# Altium project BodyCaINv0.1.PrjPcb
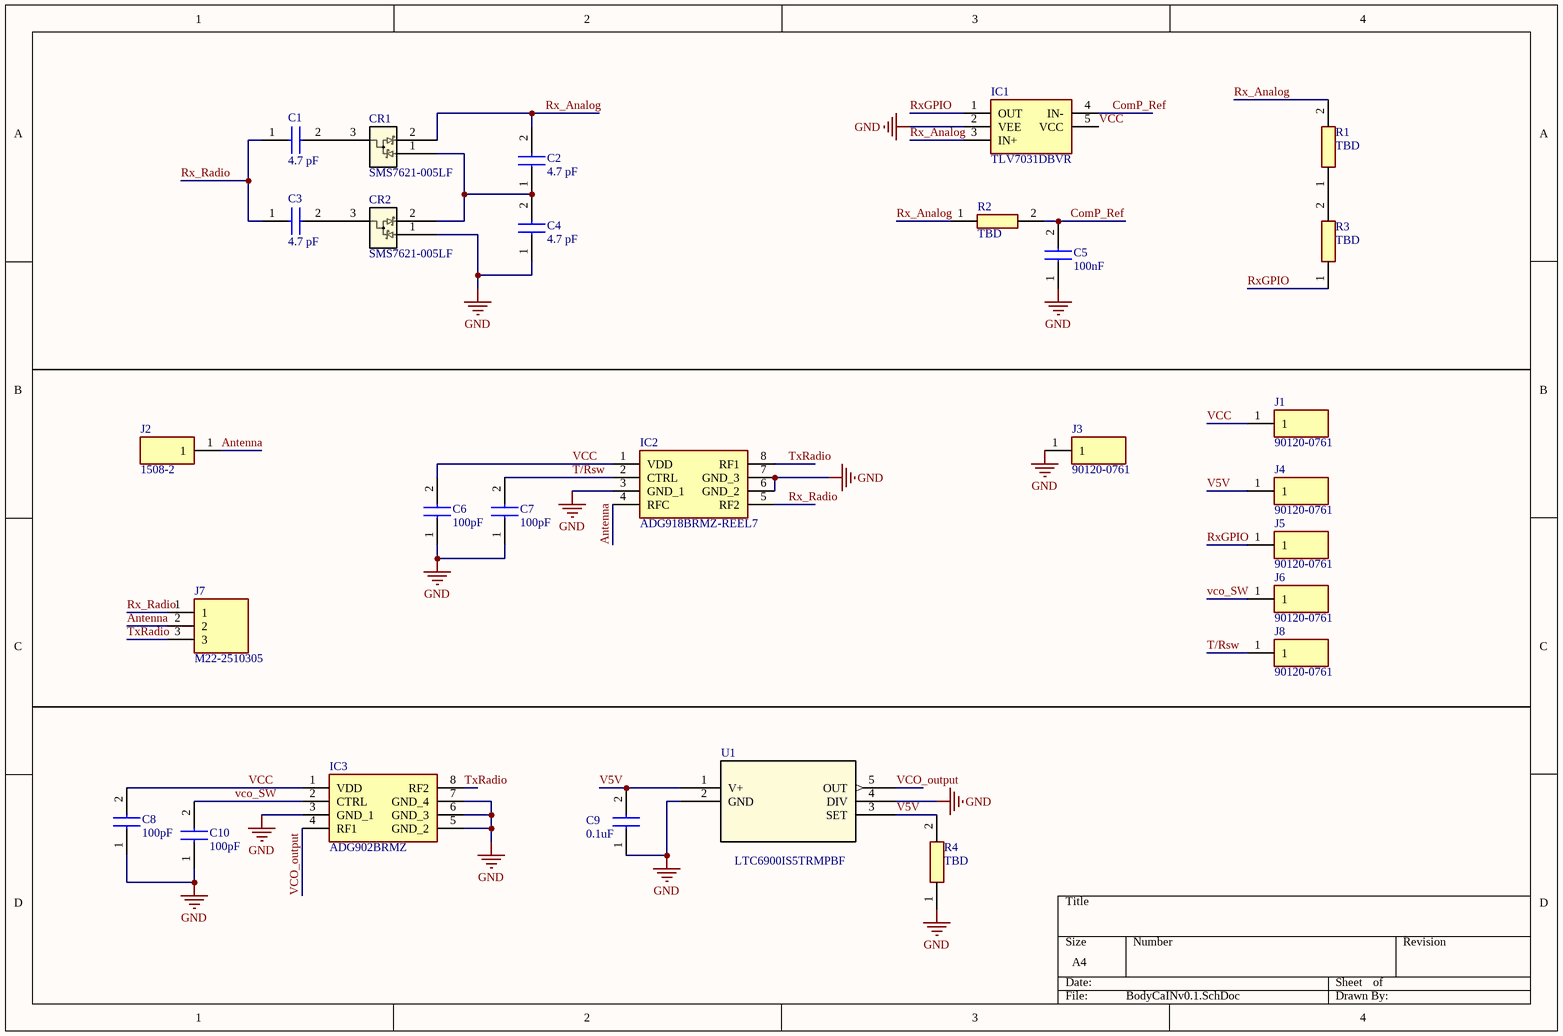
[diagram p0: BodyCaINv0.1.SchDoc]
1 sheet, 28 parts. Net scope: global (net labels, ports and power ports of the same name join across sheets).
Board file: BodyCaINv0.1.PcbDoc

## Sheet BodyCaINv0.1.SchDoc
size A4; SheetNumber: 1; SheetTotal: 1

### Parts
C1  4.7 pF  [CAPC1608X73N]
C2  4.7 pF  [CAPC1608X73N]
C3  4.7 pF  [CAPC1608X73N]
C4  4.7 pF  [CAPC1608X73N]
C5  100nF  [CAPC1608X90N]
C6  100pF  [CAPC1608X97N]
C7  100pF  [CAPC1608X97N]
C8  100pF  [CAPC1608X97N]
C9  0.1uF  [CAPC1608X100N]
C10  100pF  [CAPC1608X97N]
CR1  SMS7621-005LF  [SOT23]
CR2  SMS7621-005LF  [SOT23]
IC1  TLV7031DBVR  [SOT95P280X145-5N]
IC2  ADG918BRMZ-REEL7  [SOP65P490X110-8N]
IC3  ADG902BRMZ  [SOP65P490X110-8N]
J1  90120-0761  [HDRV1W90P0X254_1X1_232X249X560P]
J2  1508-2  [15082]
J3  90120-0761  [HDRV1W90P0X254_1X1_232X249X560P]
J4  90120-0761  [HDRV1W90P0X254_1X1_232X249X560P]
J5  90120-0761  [HDRV1W90P0X254_1X1_232X249X560P]
J6  90120-0761  [HDRV1W90P0X254_1X1_232X249X560P]
J7  M22-2510305  [HDRV3W60P0X200_1X3_600X200X525P]
J8  90120-0761  [HDRV1W90P0X254_1X1_232X249X560P]
R1  TBD  [RESC1508X46N]
R2  TBD  [RESC1508X46N]
R3  TBD  [RESC1508X46N]
R4  TBD  [RESC1508X46N]
U1  LTC6900IS5TRMPBF  [S_5_ADI]

### Nets
GND: C4.1 C5.1 C6.1 C7.1 C8.1 C9.1 C10.1 CR2.1 IC1.2(VEE) IC2.3(GND_1) IC2.6(GND_2) IC2.7(GND_3) IC3.3(GND_1) IC3.5(GND_2) IC3.6(GND_3) IC3.7(GND_4) J3.1 R4.1 U1.2(GND) U1.4(DIV)
Antenna: IC2.4(RFC) J2.1 J7.2
ComP_Ref: C5.2 IC1.4(IN-) R2.2
Rx_Analog: C2.2 CR1.2 IC1.3(IN+) R1.2 R2.1
Rx_Radio: C1.1 C3.1 IC2.5(RF2) J7.1
RxGPIO: IC1.1(OUT) J5.1 R3.1
T/Rsw: C7.2 IC2.2(CTRL) J8.1
TxRadio: IC2.8(RF1) IC3.8(RF2) J7.3
V5V: C9.2 J4.1 R4.2 U1.1(V+) U1.3(SET)
VCC: C6.2 C8.2 IC1.5(VCC) IC2.1(VDD) IC3.1(VDD) J1.1
VCO_output: IC3.4(RF1) U1.5(OUT)
vco_SW: C10.2 IC3.2(CTRL) J6.1
NetC1_2: C1.2 CR1.3
NetC2_1: C2.1 C4.2 CR1.1 CR2.2
NetC3_2: C3.2 CR2.3
NetR1_1: R1.1 R3.2

### Library data of the parts
C1-C4 = 06035J4R7BBSTR: Capacitor 06035J4R7BBSTR; Manufacturer_Name: Kyocera AVX; Datasheet Link: https://datasheets.kyocera-avx.com/Accu-P.pdf; Height: 0.73mm; Manufacturer_Part_Number: 06035J4R7BBSTR; Mouser Part Number: 581-06035J4R7BBS; Mouser Price/Stock: https://www.mouser.com/Search/Refine.aspx?Keyword=581-06035J4R7BBS; Arrow Part Number: 06035J4R7BBSTR; Arrow Price/Stock: https://www.arrow.com/en/products/06035j4r7bbstr/avx
C5 = GCM188R71H103KA37J: Capacitor GCM188R71H103KA37J; Manufacturer_Name: Murata Electronics; Datasheet Link: https://psearch.en.murata.com/capacitor/product/GCM188R71H103KA37%23.pdf; Height: 0.9mm; Manufacturer_Part_Number: GCM188R71H103KA37J; Mouser Part Number: 81-GCM188R71H103KA7J; Mouser Price/Stock: https://www.mouser.co.uk/ProductDetail/Murata-Electronics/GCM188R71H103KA37J?qs=N3Kl9KD794T3%2FxlXdF0Axg%3D%3D; Arrow Part Number: GCM188R71H103KA37J; Arrow Price/Stock: https://www.arrow.com/en/products/gcm188r71h103ka37j/murata-manufacturing?region=nac
C6-C8 C10 = VJ0603A101FXAAC: Capacitor VJ0603A101FXAAC; Manufacturer_Name: Vishay; Datasheet Link: http://www.vishay.com/docs/45226/vj31xrohsautomlcc.pdf; Height: 0.97mm; Manufacturer_Part_Number: VJ0603A101FXAAC; Mouser Part Number: 77-VJ0603A101FXAAC; Mouser Price/Stock: https://www.mouser.co.uk/ProductDetail/Vishay-Vitramon/VJ0603A101FXAAC?qs=S65kAjFE%2FJCNoIVW2knBSg%3D%3D; Arrow Part Number: VJ0603A101FXAAC; Arrow Price/Stock: https://www.arrow.com/en/products/vj0603a101fxaac/vishay?region=nac
C9 = C0603X104K1RACTU: CapacitorC0603X104K1RACTU; Manufacturer_Name: KEMET; Datasheet Link: https://search.kemet.com/component-documentation/download/specsheet/C0603X104K1RACTU; Height: 1mm; Manufacturer_Part_Number: C0603X104K1RACTU
CR1 CR2 = SMS7621-005LF: No Description Available; Mfr_Name: Skyworks; RefDes: RefDes; Type: Type
IC1 = TLV7031DBVR: Integrated Circuit; Manufacturer_Name: Texas Instruments; Datasheet Link: http://www.ti.com/lit/gpn/TLV7031; Height: 1.45mm; Manufacturer_Part_Number: TLV7031DBVR; Mouser Part Number: 595-TLV7031DBVR; Mouser Price/Stock: https://www.mouser.co.uk/ProductDetail/Texas-Instruments/TLV7031DBVR?qs=EBDBlbfErPzxbC0zg598sw%3D%3D; Arrow Part Number: TLV7031DBVR; Arrow Price/Stock: https://www.arrow.com/en/products/tlv7031dbvr/texas-instruments?region=nac
IC2 = ADG918BRMZ-REEL7: Integrated Circuit; Manufacturer_Name: Analog Devices; Datasheet Link: https://www.analog.com/media/en/technical-documentation/data-sheets/ADG918_919.pdf; Height: 1.1mm; Manufacturer_Part_Number: ADG918BRMZ-REEL7; Mouser Part Number: 584-ADG918BRMZ-R7; Mouser Price/Stock: https://www.mouser.co.uk/ProductDetail/Analog-Devices/ADG918BRMZ-REEL7?qs=BpaRKvA4VqEay0U7Dc17vw%3D%3D; Arrow Part Number: ADG918BRMZ-REEL7; Arrow Price/Stock: https://www.arrow.com/en/products/adg918brmz-reel7/analog-devices
IC3 = ADG902BRMZ: Integrated Circuit; Manufacturer_Name: Analog Devices; Datasheet Link: https://datasheet.datasheetarchive.com/originals/distributors/Datasheets-SFU1/DSASFU10004819.pdf; Height: 1.1mm; Manufacturer_Part_Number: ADG902BRMZ; Mouser Part Number: 584-ADG902BRMZ; Mouser Price/Stock: https://www.mouser.co.uk/ProductDetail/Analog-Devices/ADG902BRMZ?qs=BpaRKvA4VqGOESsiE6jGWw%3D%3D; Arrow Part Number: ADG902BRMZ; Arrow Price/Stock: https://www.arrow.com/en/products/adg902brmz/analog-devices?region=nac
J1 J3-J6 J8 = 90120-0761: Connector; Manufacturer_Name: Molex; Datasheet Link: https://www.molex.com/pdm_docs/sd/901200761_sd.pdf; Height: 5.6mm; Manufacturer_Part_Number: 90120-0761; Mouser Part Number: 538-90120-0761; Mouser Price/Stock: https://www.mouser.co.uk/ProductDetail/Molex/90120-0761?qs=PvP5v7Eimsn%2F58TpDaAAow%3D%3D
J2 = 1508-2: Connector; Manufacturer_Name: Keystone Electronics; Datasheet Link: http://keyelco.com/userAssets/file/M65p142.pdf; Height: 2.36mm; Manufacturer_Part_Number: 1508-2; Mouser Part Number: 534-1508-2; Mouser Price/Stock: https://www.mouser.com/Search/Refine.aspx?Keyword=534-1508-2
J7 = M22-2510305: Connector; Manufacturer_Name: Harwin; Datasheet Link: https://cdn.harwin.com/pdfs/M22-251.pdf; Height: 5.25mm; Manufacturer_Part_Number: M22-2510305; Mouser Part Number: 855-M22-2510305; Mouser Price/Stock: https://www.mouser.co.uk/ProductDetail/Harwin/M22-2510305?qs=Z7IUn5gUMVONkEjocUd7kg%3D%3D
R1-R4 = WSL060300000ZEA9: Resistor WSL060300000ZEA9; Manufacturer_Name: Vishay; Datasheet Link: http://www.vishay.com/docs/30192/wsl-9.pdf; Height: 0.457mm; Manufacturer_Part_Number: WSL060300000ZEA9; Mouser Part Number: 71-WSL060300000ZEA9; Mouser Price/Stock: https://www.mouser.co.uk/ProductDetail/Vishay-Dale/WSL060300000ZEA9?qs=Q7nJoqLg%252BZgzeflh6I0jJw%3D%3D; Arrow Part Number: WSL060300000ZEA9; Arrow Price/Stock: https://www.arrow.com/en/products/wsl060300000zea9/vishay?region=nac
U1 = LTC6900IS5TRMPBF: No Description Available; Mfr_Name: Analog Devices Inc; RefDes: RefDes; Type: Type